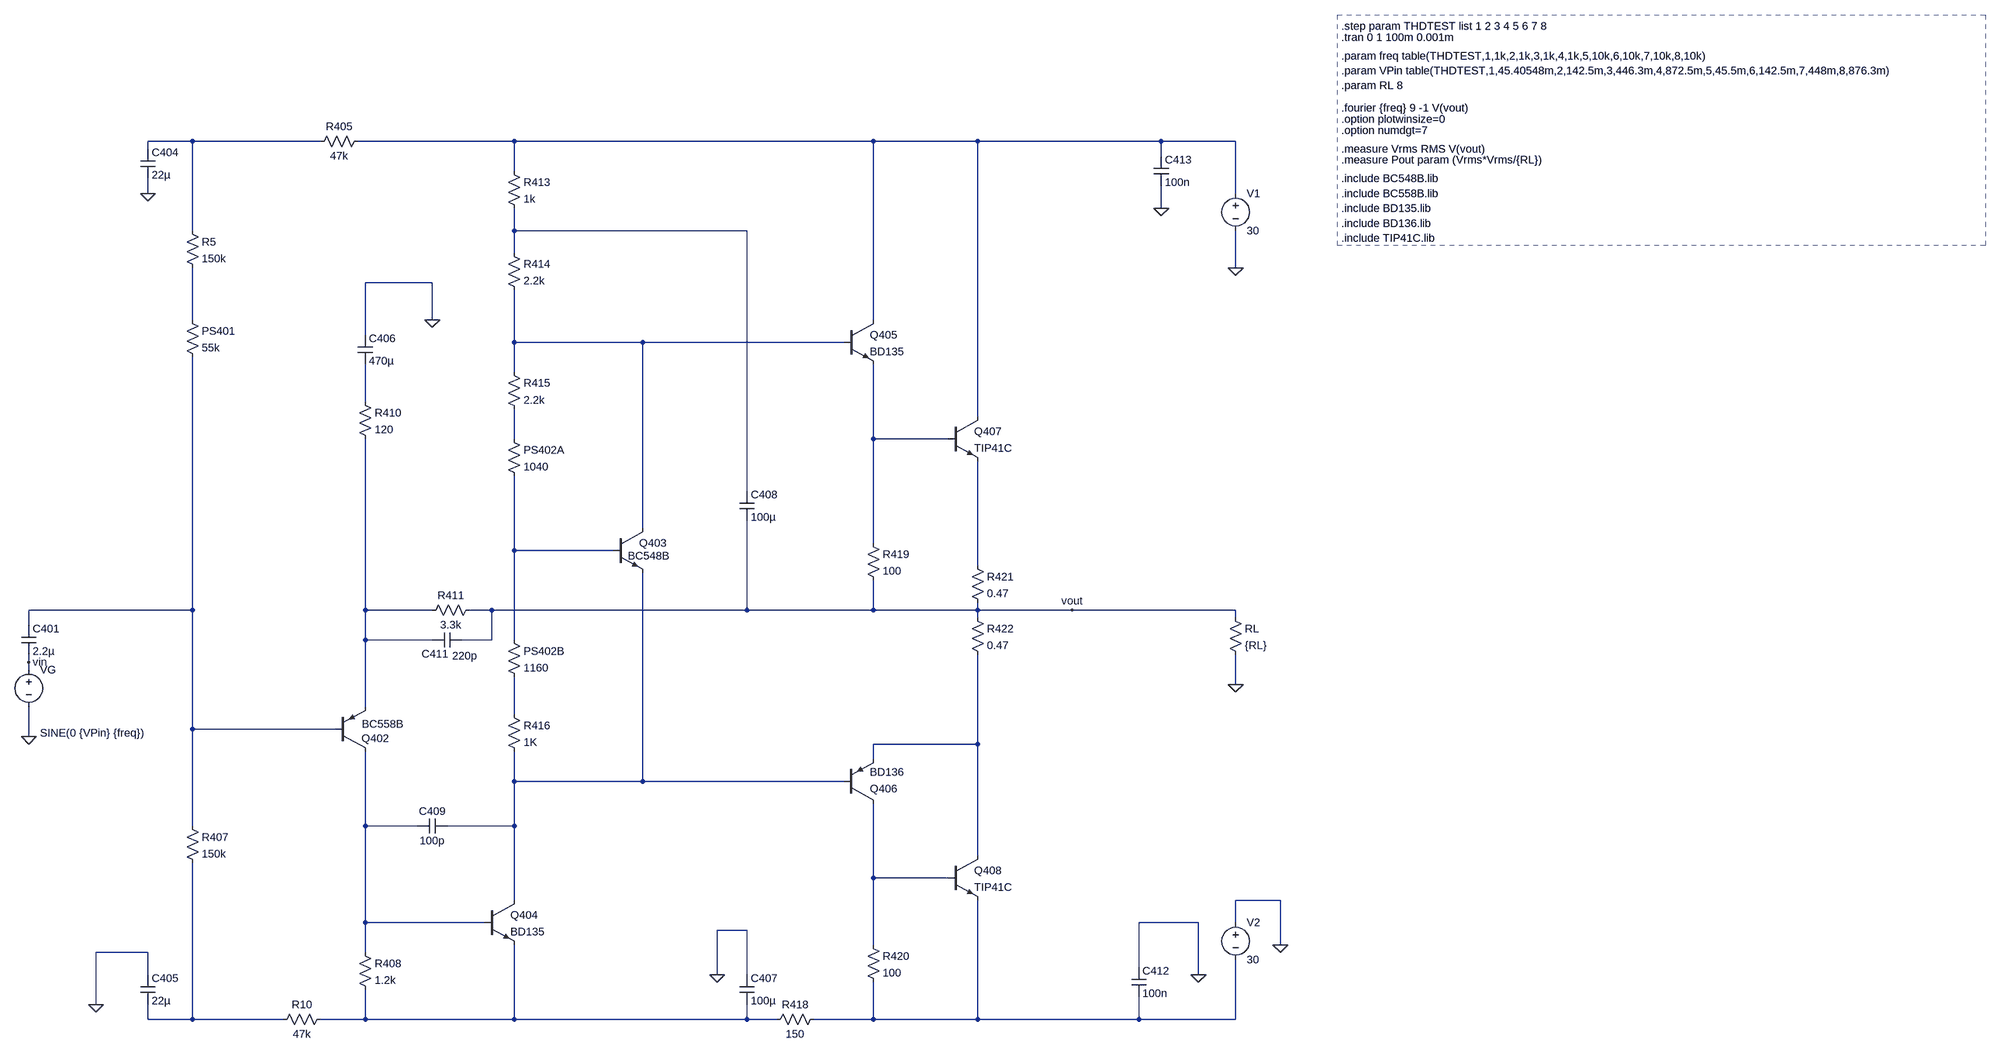
[diagram p0: schematic P11h_THD.asc]
P11h_THD.asc, the LTspice schematic file:
Version 4
SHEET 1 3220 896
WIRE -880 -1040 -976 -1040
WIRE -560 -1040 -880 -1040
WIRE -144 -1040 -480 -1040
WIRE 640 -1040 -144 -1040
WIRE 864 -1040 640 -1040
WIRE 1360 -1040 864 -1040
WIRE 1520 -1040 1360 -1040
WIRE -976 -1024 -976 -1040
WIRE 1360 -1008 1360 -1040
WIRE -144 -976 -144 -1040
WIRE -976 -928 -976 -960
WIRE 1520 -928 1520 -1040
WIRE 1360 -896 1360 -944
WIRE -880 -848 -880 -1040
WIRE -144 -848 -144 -896
WIRE 368 -848 -144 -848
WIRE -144 -800 -144 -848
WIRE 1520 -768 1520 -848
WIRE -320 -736 -464 -736
WIRE -880 -656 -880 -768
WIRE -320 -656 -320 -736
WIRE 640 -656 640 -1040
WIRE -464 -624 -464 -736
WIRE -144 -608 -144 -720
WIRE 144 -608 -144 -608
WIRE 576 -608 144 -608
WIRE -144 -544 -144 -608
WIRE -464 -480 -464 -560
WIRE 864 -448 864 -1040
WIRE -144 -400 -144 -464
WIRE 640 -400 640 -560
WIRE 800 -400 640 -400
WIRE 368 -288 368 -848
WIRE 144 -208 144 -608
WIRE 640 -176 640 -400
WIRE -144 -160 -144 -320
WIRE 80 -160 -144 -160
WIRE 864 -128 864 -352
WIRE -880 -32 -880 -576
WIRE -880 -32 -1232 -32
WIRE -464 -32 -464 -400
WIRE -320 -32 -464 -32
WIRE -192 -32 -240 -32
WIRE 368 -32 368 -224
WIRE 368 -32 -192 -32
WIRE 640 -32 640 -96
WIRE 640 -32 368 -32
WIRE 864 -32 864 -48
WIRE 864 -32 640 -32
WIRE 1120 -32 864 -32
WIRE 1520 -32 1120 -32
WIRE 864 -16 864 -32
WIRE 1520 -16 1520 -32
WIRE -1232 0 -1232 -32
WIRE -464 32 -464 -32
WIRE -320 32 -464 32
WIRE -192 32 -192 -32
WIRE -192 32 -256 32
WIRE -144 32 -144 -160
WIRE -1232 80 -1232 64
WIRE -1232 96 -1232 80
WIRE 1520 128 1520 64
WIRE -464 176 -464 32
WIRE -144 192 -144 112
WIRE -880 224 -880 -32
WIRE -528 224 -880 224
WIRE -1232 240 -1232 176
WIRE 864 256 864 64
WIRE 864 256 640 256
WIRE 640 288 640 256
WIRE -144 336 -144 272
WIRE 144 336 144 -112
WIRE 144 336 -144 336
WIRE 576 336 144 336
WIRE -880 432 -880 224
WIRE -464 432 -464 272
WIRE -352 432 -464 432
WIRE -144 432 -144 336
WIRE -144 432 -288 432
WIRE 864 496 864 256
WIRE 640 544 640 384
WIRE 800 544 640 544
WIRE -144 592 -144 432
WIRE 1616 592 1520 592
WIRE -464 640 -464 432
WIRE -208 640 -464 640
WIRE 1440 640 1312 640
WIRE 1520 640 1520 592
WIRE 368 656 304 656
WIRE 640 688 640 544
WIRE 1616 688 1616 592
WIRE -976 704 -1088 704
WIRE -464 704 -464 640
WIRE 1312 736 1312 640
WIRE -976 752 -976 704
WIRE 304 752 304 656
WIRE 368 752 368 656
WIRE 1440 752 1440 640
WIRE -1088 816 -1088 704
WIRE -976 848 -976 816
WIRE -880 848 -880 512
WIRE -880 848 -976 848
WIRE -640 848 -880 848
WIRE -464 848 -464 784
WIRE -464 848 -560 848
WIRE -144 848 -144 688
WIRE -144 848 -464 848
WIRE 368 848 368 816
WIRE 368 848 -144 848
WIRE 432 848 368 848
WIRE 640 848 640 768
WIRE 640 848 512 848
WIRE 864 848 864 592
WIRE 864 848 640 848
WIRE 1312 848 1312 800
WIRE 1312 848 864 848
WIRE 1520 848 1520 720
WIRE 1520 848 1312 848
FLAG -976 -928 0
FLAG -1232 240 0
FLAG -320 -656 0
FLAG 1360 -896 0
FLAG 1440 752 0
FLAG 1616 688 0
FLAG -1088 816 0
FLAG 1520 128 0
FLAG 1520 -768 0
FLAG 304 752 0
FLAG 1120 -32 vout
FLAG -1232 80 vin
DATAFLAG 1360 -32 ""
DATAFLAG 864 -544 "Ic(Q407)"
DATAFLAG 864 384 "Ic(Q408)"
DATAFLAG 640 -736 "Ic(Q405)"
DATAFLAG 640 464 "Ic(Q406)"
DATAFLAG -464 352 "-Ic(Q402)"
DATAFLAG -144 512 "-Ie(Q404)"
DATAFLAG 144 -288 "Ic(Q403)"
DATAFLAG -144 336 ""
DATAFLAG -32 -608 ""
DATAFLAG -880 -304 "I(Ps401)"
DATAFLAG 720 -400 "Ib(Q407)"
DATAFLAG 640 624 ""
DATAFLAG 496 -32 ""
DATAFLAG -384 -32 ""
DATAFLAG 80 -848 ""
DATAFLAG -144 -112 ""
DATAFLAG 864 -160 ""
DATAFLAG 864 176 ""
DATAFLAG -880 848 ""
DATAFLAG -880 -1040 ""
DATAFLAG -144 -1040 ""
DATAFLAG 640 -288 ""
DATAFLAG 736 544 "Ib(Q408)"
DATAFLAG 704 256 "Ie(Q406)"
DATAFLAG 640 -496 "Ie(Q405)"
DATAFLAG 464 336 "Ib(Q406)"
DATAFLAG 464 -608 "Ib(Q405)"
DATAFLAG -144 -688 "I(R414)"
DATAFLAG -144 -288 "I(Ps402a)"
DATAFLAG -32 -160 "Ib(Q403)"
DATAFLAG -880 48 ""
DATAFLAG -608 224 "Ib(Q402)"
DATAFLAG 864 -320 "Ie(Q407)"
DATAFLAG 864 704 "Ie(Q408)"
DATAFLAG -464 96 "Ie(Q402)"
DATAFLAG -880 384 "I(R407)"
DATAFLAG -640 -1040 "I(R405)"
DATAFLAG -704 848 "I(R10)"
DATAFLAG 560 848 "I(R418)"
DATAFLAG -16 848 ""
DATAFLAG -144 752 "Ie(Q404)"
DATAFLAG -336 640 "Ib(Q404)"
DATAFLAG -464 688 "I(R408)"
DATAFLAG -144 160 "I(Ps402b)"
DATAFLAG 144 128 "Ie(Q403)"
SYMBOL res -896 -864 R0
SYMATTR InstName R5
SYMATTR Value 150k
SYMBOL res -464 -1056 R90
WINDOW 0 0 56 VBottom 2
WINDOW 3 32 56 VTop 2
SYMATTR InstName R405
SYMATTR Value 47k
SYMBOL res -896 -672 R0
SYMATTR InstName PS401
SYMATTR Value 55k
SYMBOL cap -992 -960 M180
WINDOW 0 24 56 Left 2
WINDOW 3 24 8 Left 2
SYMATTR InstName C404
SYMATTR Value 22µ
SYMBOL res -896 416 R0
SYMATTR InstName R407
SYMATTR Value 150k
SYMBOL voltage -1232 80 R0
WINDOW 123 24 124 Left 2
WINDOW 39 0 0 Left 0
WINDOW 3 24 152 Left 2
SYMATTR Value SINE(0 {VPin} {freq})
SYMATTR InstName VG
SYMBOL cap -1248 0 R0
SYMATTR InstName C401
SYMATTR Value 2.2µ
SYMBOL pnp -528 272 M180
WINDOW 0 56 28 Left 2
WINDOW 3 57 59 Left 2
SYMATTR InstName Q402
SYMATTR Value BC558B
SYMBOL res -480 -496 R0
SYMATTR InstName R410
SYMATTR Value 120
SYMBOL cap -480 -624 R0
SYMATTR InstName C406
SYMATTR Value 470µ
SYMBOL res -480 688 R0
SYMATTR InstName R408
SYMATTR Value 1.2k
SYMBOL res -336 -16 R270
WINDOW 0 32 56 VTop 2
WINDOW 3 0 56 VBottom 2
SYMATTR InstName R411
SYMATTR Value 3.3k
SYMBOL res -160 -992 R0
SYMATTR InstName R413
SYMATTR Value 1k
SYMBOL res -160 -816 R0
SYMATTR InstName R414
SYMATTR Value 2.2k
SYMBOL res -160 -560 R0
SYMATTR InstName R415
SYMATTR Value 2.2k
SYMBOL res -160 16 R0
SYMATTR InstName PS402B
SYMATTR Value 1160
SYMBOL res -160 176 R0
SYMATTR InstName R416
SYMATTR Value 1K
SYMBOL npn -208 592 R0
SYMATTR InstName Q404
SYMATTR Value BD135
SYMBOL npn 80 -208 R0
WINDOW 3 32 59 Left 2
SYMATTR Value BC548B
SYMATTR InstName Q403
SYMBOL npn 576 -656 R0
SYMATTR InstName Q405
SYMATTR Value BD135
SYMBOL npn 800 -448 R0
SYMATTR InstName Q407
SYMATTR Value TIP41C
SYMBOL npn 800 496 R0
SYMATTR InstName Q408
SYMATTR Value TIP41C
SYMBOL pnp 576 384 M180
SYMATTR InstName Q406
SYMATTR Value BD136
SYMBOL res 848 -144 R0
SYMATTR InstName R421
SYMATTR Value 0.47
SYMBOL res 624 -192 R0
SYMATTR InstName R419
SYMATTR Value 100
SYMBOL res 624 672 R0
SYMATTR InstName R420
SYMATTR Value 100
SYMBOL res 848 -32 R0
SYMATTR InstName R422
SYMATTR Value 0.47
SYMBOL cap 1344 -1008 R0
SYMATTR InstName C413
SYMATTR Value 100n
SYMBOL cap 1296 736 R0
SYMATTR InstName C412
SYMATTR Value 100n
SYMBOL voltage 1520 -944 R0
SYMATTR InstName V1
SYMATTR Value 30
SYMBOL voltage 1520 624 R0
SYMATTR InstName V2
SYMATTR Value 30
SYMBOL res 1504 -32 R0
SYMATTR InstName RL
SYMATTR Value {RL}
SYMBOL res 416 864 R270
WINDOW 0 32 56 VTop 2
WINDOW 3 0 56 VBottom 2
SYMATTR InstName R418
SYMATTR Value 150
SYMBOL res -656 864 R270
WINDOW 0 32 56 VTop 2
WINDOW 3 0 56 VBottom 2
SYMATTR InstName R10
SYMATTR Value 47k
SYMBOL cap -992 752 R0
SYMATTR InstName C405
SYMATTR Value 22µ
SYMBOL cap 352 752 R0
SYMATTR InstName C407
SYMATTR Value 100µ
SYMBOL cap 352 -288 R0
SYMATTR InstName C408
SYMATTR Value 100µ
SYMBOL cap -256 16 R90
WINDOW 0 62 58 VBottom 2
WINDOW 3 35 -6 VTop 2
SYMATTR InstName C411
SYMATTR Value 220p
SYMBOL cap -288 416 R90
WINDOW 0 0 32 VBottom 2
WINDOW 3 32 32 VTop 2
SYMATTR InstName C409
SYMATTR Value 100p
SYMBOL res -160 -416 R0
SYMATTR InstName PS402A
SYMATTR Value 1040
TEXT 1832 -928 Left 2 !.include BC558B.lib
TEXT 1832 -960 Left 2 !.include BC548B.lib
TEXT 1832 -832 Left 2 !.include TIP41C.lib
TEXT 1832 -896 Left 2 !.include BD135.lib
TEXT 1832 -864 Left 2 !.include BD136.lib
TEXT 1832 -1264 Left 2 !.tran 0 1 100m 0.001m
TEXT 1832 -1112 Left 2 !.fourier {freq} 9 -1 V(vout)
TEXT 1832 -1088 Left 2 !.option plotwinsize=0
TEXT 1832 -1160 Left 2 !.param RL 8
TEXT 1832 -1224 Left 2 !.param freq table(THDTEST,1,1k,2,1k,3,1k,4,1k,5,10k,6,10k,7,10k,8,10k)
TEXT 1832 -1192 Left 2 !.param VPin table(THDTEST,1,45.40548m,2,142.5m,3,446.3m,4,872.5m,5,45.5m,6,142.5m,7,448m,8,876.3m)
TEXT 1832 -1288 Left 2 !.step param THDTEST list 1 2 3 4 5 6 7 8
TEXT 1832 -1064 Left 2 !.option numdgt=7
TEXT 1832 -1024 Left 2 !.measure Vrms RMS V(vout)
TEXT 1832 -1000 Left 2 !.measure Pout param (Vrms*Vrms/{RL})
RECTANGLE Normal 3216 -816 1824 -1312 3

The netlist it stands for:
* P11h_THD.asc
R5 N001 N004 150k
R405 N002 N001 47k
R§PS401 N004 N011 55k
C404 0 N001 22µ
R407 N011 N018 150k
VG vin 0 SINE(0 {VPin} {freq})
C401 N011 vin 2.2µ
Q402 N016 N011 N012 0 BC558B
R410 N006 N012 120
C406 0 N006 470µ
R408 N016 N019 1.2k
R411 N012 vout 3.3k
R413 N002 N003 1k
R414 N003 N005 2.2k
R415 N005 N007 2.2k
R§PS402B N009 N013 1160
R416 N013 N015 1K
Q404 N015 N016 N019 0 BD135
Q403 N005 N009 N015 0 BC548B
Q405 N002 N005 N008 0 BD135
Q407 N002 N008 N010 0 TIP41C
Q408 N014 N017 N020 0 TIP41C
Q406 N017 N015 N014 0 BD136
R421 N010 vout 0.47
R419 N008 vout 100
R420 N017 N020 100
R422 vout N014 0.47
C413 N002 0 100n
C412 0 N020 100n
V1 N002 0 30
V2 0 N020 30
RL vout 0 {RL}
R418 N019 N020 150
R10 N018 N019 47k
C405 0 N018 22µ
C407 0 N019 100µ
C408 N003 vout 100µ
C411 vout N012 220p
C409 N015 N016 100p
R§PS402A N007 N009 1040
.model NPN NPN
.model PNP PNP
.lib standard.bjt
.include BC558B.lib
.include BC548B.lib
.include TIP41C.lib
.include BD135.lib
.include BD136.lib
.tran 0 1 100m 0.001m
.fourier {freq} 9 -1 V(vout)
.option plotwinsize=0
.param RL 8
.param freq table(THDTEST,1,1k,2,1k,3,1k,4,1k,5,10k,6,10k,7,10k,8,10k)
.param VPin table(THDTEST,1,45.40548m,2,142.5m,3,446.3m,4,872.5m,5,45.5m,6,142.5m,7,448m,8,876.3m)
.step param THDTEST list 1 2 3 4 5 6 7 8
.option numdgt=7
.measure Vrms RMS V(vout)
.measure Pout param (Vrms*Vrms/{RL})
.backanno
.end